# EAGLE design ALARMV3 (EAGLE 9.5.1)
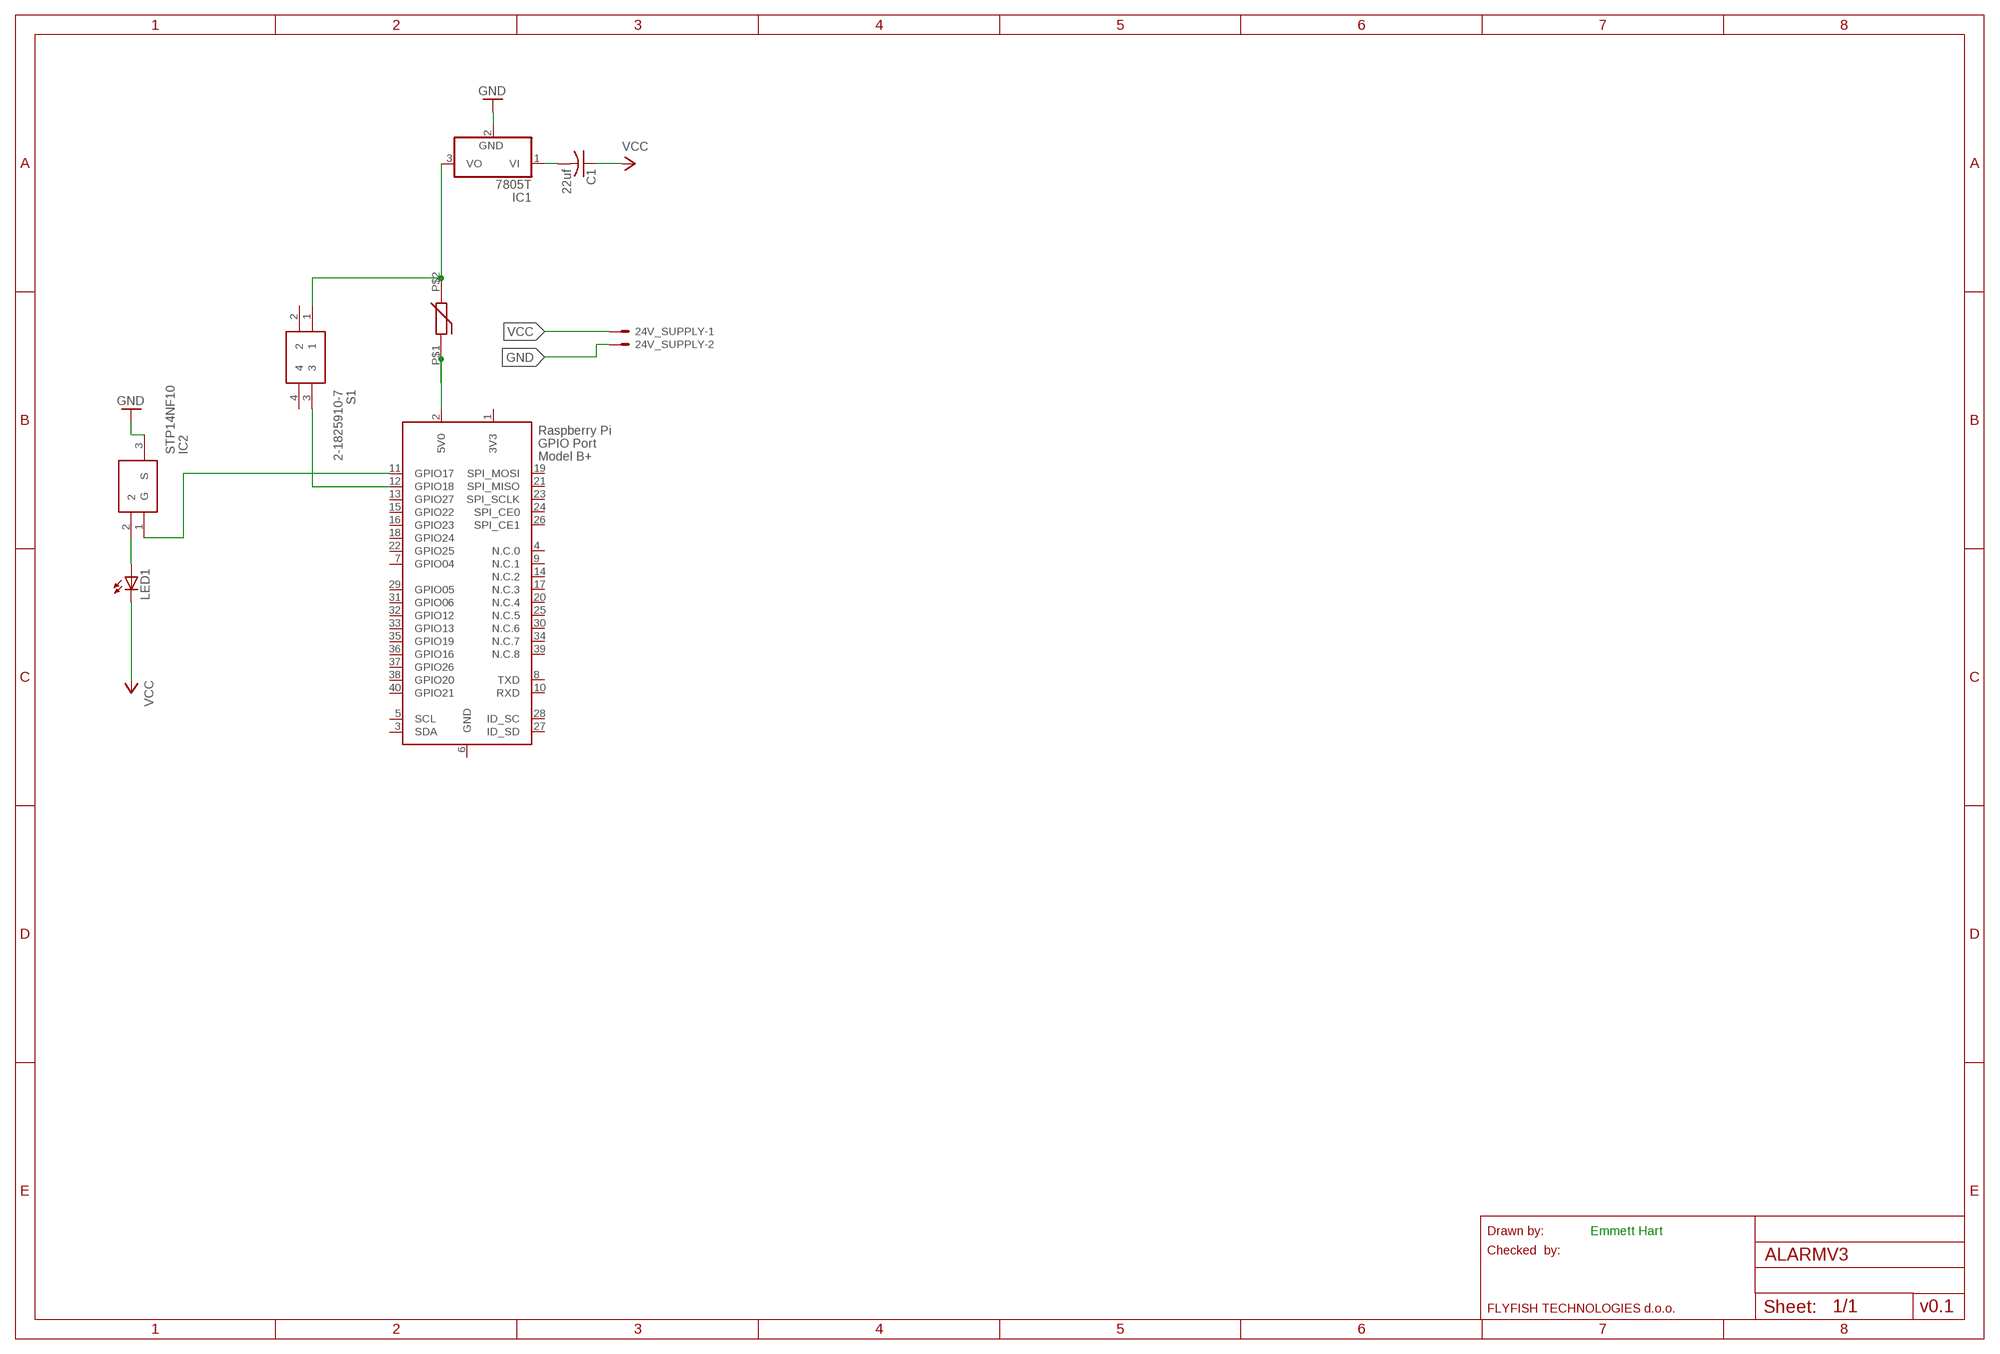
[diagram p0: schematic, sheet 1]

## Parts
24V_SUPPLY  22-23-2021  [22-23-2021]
C1  22uf  C-US050-024X044  [C050-024X044]
F1  MF-MSMF260-2  [MF-MSMF260-2]
IC1  7805T  [TO220H]
IC2  STP14NF10  [TO270P460X1020X2008-3P]
LED1  LEDSFH482  [SFH482]
S1  2-1825910-7  [TE-6MM-TACT-SWITCH]
X1  RASPI_BOARD_B+_E0  [RASPI_BOARD_B+_EDGES_0DRILL]

## Nets
GND: 24V_SUPPLY.2 IC1.2(GND) IC2.3(S)
GPIO17: IC2.1(G) X1.11(GPIO17)
N$1: F1.P$1 X1.2(5V0)
N$3: S1.3 X1.12(GPIO18)
N$4: C1.2 IC1.1(VI)
N$5: F1.P$2 IC1.3(VO) S1.1
N$6: IC2.2 LED1.A
VCC: 24V_SUPPLY.1 C1.1 LED1.K(C)
Unconnected: S1.2 S1.4 X1.3(SDA) X1.4(N.C.0) X1.5(SCL) X1.7(GPIO04) X1.8(TXD) X1.9(N.C.1) X1.10(RXD) X1.13(GPIO27) X1.14(N.C.2) X1.15(GPIO22) X1.16(GPIO23) X1.17(N.C.3) X1.18(GPIO24) X1.19(SPI_MOSI) X1.20(N.C.4) X1.21(SPI_MISO) X1.22(GPIO25) X1.23(SPI_SCLK) X1.24(SPI_CE0) X1.25(N.C.5) X1.26(SPI_CE1) X1.27(ID_SD) X1.28(ID_SC) X1.29(GPIO05) X1.30(N.C.6) X1.31(GPIO06) X1.32(GPIO12) X1.33(GPIO13) X1.34(N.C.7) X1.35(GPIO19) X1.36(GPIO16) X1.37(GPIO26) X1.38(GPIO20) X1.39(N.C.8) X1.40(GPIO21)

## Notes on the sheet
- Drawn by: | Emmett Hart
- Checked  by:
- FLYFISH TECHNOLOGIES d.o.o. | v0.1

## Power pins joined to a net without a drawn wire
3V3: X1.1(3V3)
GND: X1.6(GND)

## Library data of the parts
24V_SUPPLY = con-molex:22-23-2021: .100" (2.54mm) Center Header - 2 Pin; MF: MOLEX; MPN: 22-23-2021; OC_FARNELL: 1462926; OC_NEWARK: 25C3832
C1 = adafruit:C-US: CAPACITOR, American symbol
F1 = Test:MF-MSMF260-2
IC1 = linear:78*: Positive VOLTAGE REGULATOR Source: http://cache.national.com/ds/LM/LM78L05.pdf http://www.fairchildsemi.com/ds/LM/LM7805.pdf; MPN: NCP7805TG; OC_NEWARK: 81Y6957
IC2 = SamacSys_Parts:STP14NF10: STP14NF10, N-channel MOSFET Transistor 15 A 100 V, 3-Pin TO-220 Source: Datasheet <https://componentsearchengine.com/Datasheets/1/STP14NF10.pdf>; DESCRIPTION: STP14NF10, N-channel MOSFET Transistor 15 A 100 V, 3-Pin TO-220; HEIGHT: 4.6mm; MANUFACTURER_NAME: STMicroelectronics; MANUFACTURER_PART_NUMBER: STP14NF10; MOUSER_PART_NUMBER: 511-STP14NF10; MOUSER_PRICE-STOCK: https://www.mouser.com/Search/Refine.aspx?Keyword=511-STP14NF10
LED1 = adafruit:LED: LED OSRAM: - CHIPLED LG R971, LG N971, LY N971, LG Q971, LY Q971, LO R971, LY R971 LH N974, LH R974 LS Q976, LO Q976, LY Q976 LO Q996 - Hyper CHIPLED LW Q18S LB Q993, LB Q99A, LB R99A - SideLED LS A670, LO A670, LY A670, LG A670, LP A670 LB A673, LV A673, LT A673, LW A673 LH A674 LY A675 LS A676, LA A676, LO A676, LY A676, LW A676 LS A679, LY A679, LG A679 - Hyper Micro SIDELED® LS Y876, LA Y876, LO Y876, LY Y876 LT Y87S - SmartLED LW L88C, LW L88S LB L89C, LB L89S, LG L890 LS L89K, LO L89K, LY L89K LS L896, LA L896, LO L896, LY L896 - TOPLED LS T670, LO T670, LY T670, LG T670, LP T670 LSG T670, LSP T670, LSY T670, LOP T670, LYG T670 LG T671, LOG T671, LSG T671 LB T673, LV T673, LT T673, LW T673 LH T674 LS T676, LA T676, LO T676, LY T676, LB T676, LH T676, LSB T676, LW T676 LB T67C, LV T67C, LT T67C, LS T67K, LO T67K, LY T67K, LW E67C LS E67B, LA E67B, LO E67B, LY E67B, LB E67C, LV E67C, LT E67C LW T67C LS T679, LY T679, LG T679 LS T770, LO T770, LY T770, LG T770, LP T770 LB T773, LV T773, LT T773, LW T773 LH T774 LS E675, LA E675, LY E675, LS T675 LS T776, LA T776, LO T776, LY T776, LB T776 LHGB T686 LT T68C, LB T68C - Hyper Mini TOPLED® LB M676 - Mini TOPLED Santana® LG M470 LS M47K, LO M47K, LY M47K Source: http://www.osram.convergy.de/; OC_NEWARK: unknown
S1 = SamacSys_Parts:2-1825910-7: Black Tactile Tactile Switch, SPST 50 mA 9.4mm Source: Datasheet <https://componentsearchengine.com/Datasheets/1/2-1825910-7.pdf>; DESCRIPTION: Black Tactile Tactile Switch, SPST 50 mA 9.4mm; HEIGHT: mm; MANUFACTURER_NAME: TE Connectivity; MANUFACTURER_PART_NUMBER: 2-1825910-7; MOUSER_PART_NUMBER: 506-2-1825910-7; MOUSER_PRICE-STOCK: https://www.mouser.com/Search/Refine.aspx?Keyword=506-2-1825910-7
X1 = raspberrypi_bastelstube_v13:RASPI_BOARD_B+: Raspberry Pi GPIO connector with markings for the outer dimensions of the Raspberry Pi board model B+ with different sets of drill holes or mounting pads; OC_NEWARK: unknown

## Net classes
0 default: width 0.305 mm, drill 0.508 mm, clearance 0.254 mm

## Board
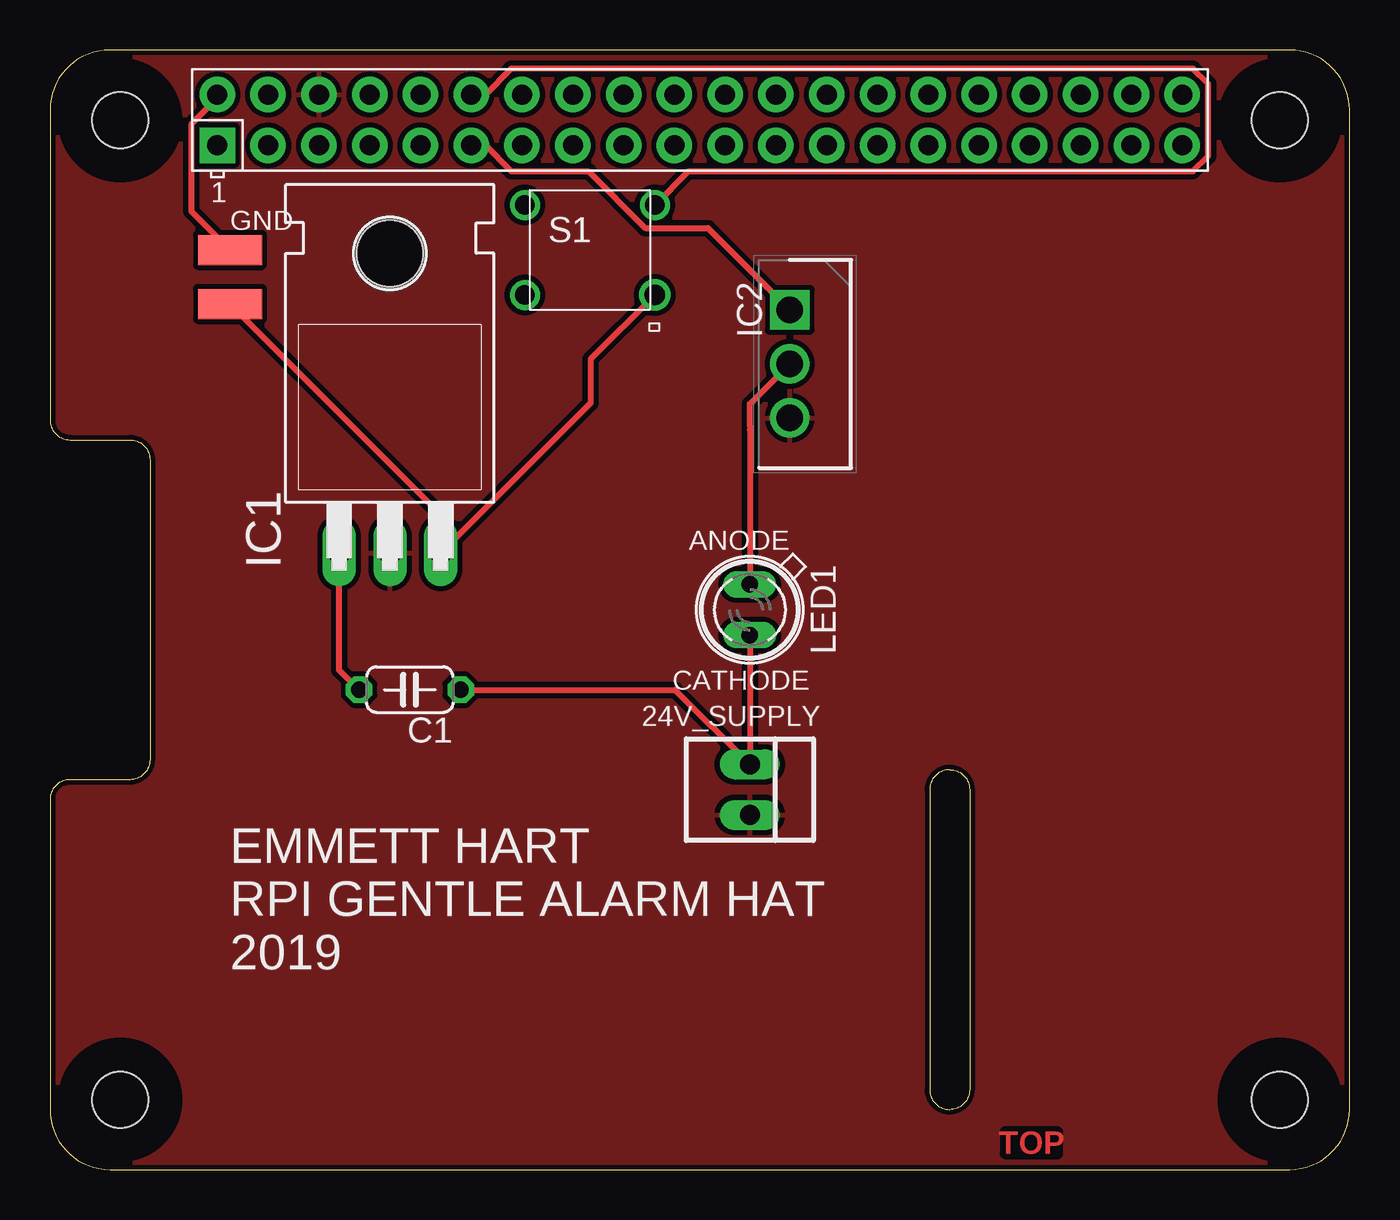
[diagram p1: board, top side]
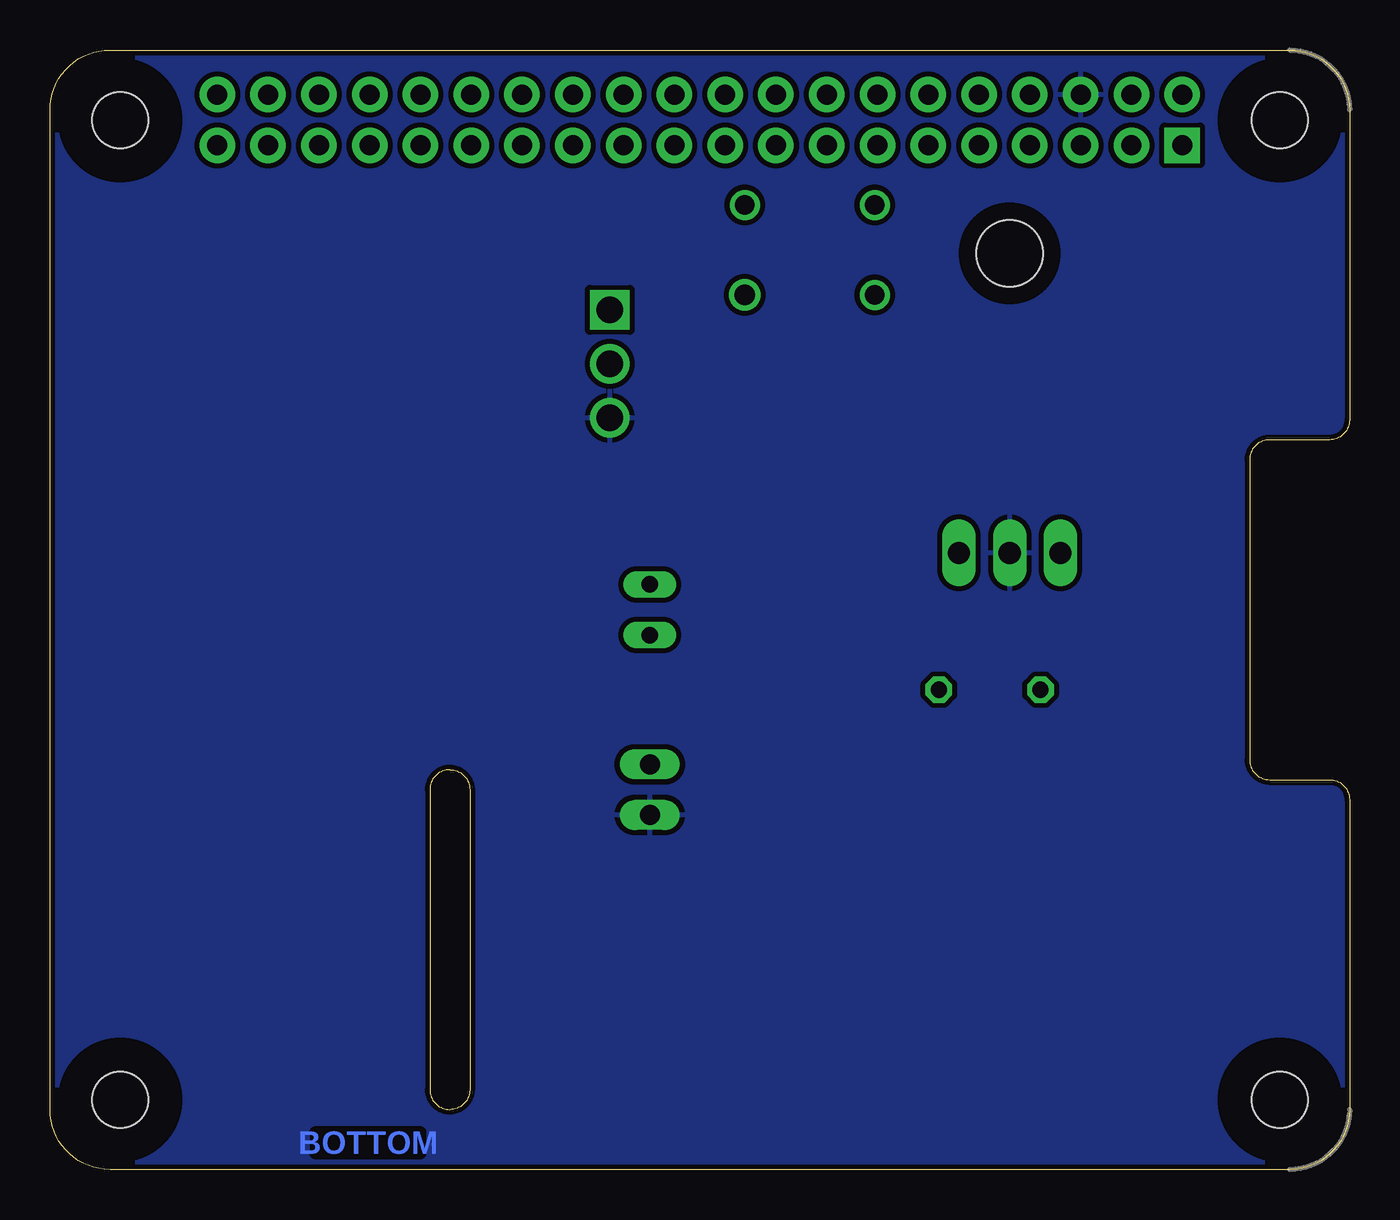
[diagram p2: board, bottom side, seen from below]

Size 65 x 56 mm. Coordinates in mm from the lower left corner, seen from the top.
Outline: 0,3 arc90 3,0 62,0 arc90 65,3 65,53 arc90 62,56 3,56 arc90 0,53 0,37.5 arc90 1,36.5 4,36.5 arc-90 5,35.5 5,20.5 arc-90 4,19.5 1,19.5 arc90 0,18.5 0,3
Outline: 44,19 44,4 arc90 45,3 arc90 46,4 46,19 arc90 45,20 arc90 44,19
Copper layers (1*16): Top 0.035mm / dielectric 1.5mm / Bottom 0.035mm
Design rules "ITEADstudio_DRC": minimum track width 6mil, minimum drill 12mil, track to track 6mil, track to pad 6mil, pad to pad 6mil, via to via 6mil, smd to smd 0mil, copper to edge 10mil, drill to drill 10mil, minimum pad ring 10mil, minimum via ring 6mil, stop-mask expansion 2mil, vias tented up to drill 100mil, thermal gap 10mil
Holes 2.8 mm at 3.5,3.5 3.5,52.5 61.5,52.5 61.5,3.5
tRestrict: area 1.9,51 to 5,54; area 60,51 to 63,54; area 60,1.9 to 63,5; area 1.9,1.9 to 5,5
bRestrict: area 1.9,1.9 to 5,5; area 1.9,51 to 5,54; area 60,1.9 to 63,5; area 60,51 to 63,54
Milling: 6 lines

### Footprints (pad centres in the part's own frame; a part is rotated, then mirrored left to right if it is on the bottom)
22-23-2021 = drill 1 long: 1 -1.27,0; 2 1.27,0
C050-024X044 = drill 0.813 octagon: 1 -2.54,0; 2 2.54,0
MF-MSMF260-2 = smd 1.5 x 3.2: P$1 0,0; P$2 -2.7,0
TO220H = drill 1.118 long: 1 -2.54,-10.16; 2 0,-10.16; 3 2.54,-10.16 | hole 3.302: 0,4.826
TO270P460X1020X2008-3P = drill 1.32 pad 1.98 square: 1 0,0 | drill 1.32 pad 1.98: 2 2.7,0; 3 5.4,0
SFH482 = drill 0.813 long: A -1.27,0; K 1.27,0
TE-6MM-TACT-SWITCH = drill 1.04 pad 1.54: 1 3.25,-2.25 | drill 0.99 pad 1.5: 2 -3.25,-2.25; 3 3.25,2.25; 4 -3.25,2.25
RASPI_BOARD_B+_EDGES_0DRILL = drill 1 pad 1.778 square: 1 8.37,51.23 | drill 1 pad 1.778: 2 8.37,53.77; 3 10.91,51.23; 4 10.91,53.77; 5 13.45,51.23; 6 13.45,53.77; 7 15.99,51.23; 8 15.99,53.77; 9 18.53,51.23; 10 18.53,53.77; 11 21.07,51.23; 12 21.07,53.77; 13 23.61,51.23; 14 23.61,53.77; 15 26.15,51.23; 16 26.15,53.77; 17 28.69,51.23; 18 28.69,53.77; 19 31.23,51.23; 20 31.23,53.77; 21 33.77,51.23; 22 33.77,53.77; 23 36.31,51.23; 24 36.31,53.77; 25 38.85,51.23; 26 38.85,53.77; 27 41.39,51.23; 28 41.39,53.77; 29 43.93,51.23; 30 43.93,53.77; 31 46.47,51.23; 32 46.47,53.77; 33 49.01,51.23; 34 49.01,53.77; 35 51.55,51.23; 36 51.55,53.77; 37 54.09,51.23; 38 54.09,53.77; 39 56.63,51.23; 40 56.63,53.77

### Placement (x,y rotation side)
24V_SUPPLY  35,19 270 top
C1  18,24 180 top
F1  9,46 90 top
IC1  17,41 0 top
IC2  37,43 270 top
LED1  35,28 270 top
S1  27,46 0 top
X1  0,0 0 top

### Tracks (layer width: path | path; a pad name or v marks a point on that pad's centre or on a via)
GND
  pour Bottom: 0,3 arc90 3,0 62,0 arc90 65,3 65,53 arc90 62,56 3,56 arc90 0,53 0,37.5 arc90 1,36.5 4,36.5 arc-90 5,35.5 5,20.5 arc-90 4,19.5 1,19.5 arc90 0,18.5
  pour Top: 0,3 arc90 3,0 62,0 arc90 65,3 65,53 arc90 62,56 3,56 arc90 0,53 0,37.5 arc90 1,36.5 4,36.5 arc-90 5,35.5 5,20.5 arc-90 4,19.5 1,19.5 arc90 0,18.5
GPIO17
  Top 0.305: X1.11 21.78,51.23 23.07,49.94 26.93,49.94 29.77,47.09 32.91,47.09 IC2.1
N$1
  Top 0.305: X1.2 8.37,53.58 7.08,52.29 7.08,47.92 F1.P$1
N$3
  Top 0.305: X1.12 21.78,53.77 23.07,55.06 57.17,55.06 57.92,54.31 57.92,50.69 57.17,49.94 31.93,49.94 S1.3
N$4
  Top 0.305: C1.2 14.46,25 IC1.1
N$5
  Top 0.305: S1.1 27.04,40.54 27.04,38.34 IC1.3 19.54,32.76 F1.P$2
N$6
  Top 0.305: LED1.A 35,37 35,37.22 35,38.3 IC2.2
VCC
  Top 0.305: C1.1 31.27,24 24V_SUPPLY.1 LED1.K

### Text on the board
Top: TOP
Bottom: BOTTOM
tPlace: EMMETT HART / RPI GENTLE ALARM HAT / 2019
tNames: GND | ANODE | CATHODE